# Altium schematic sheet PowerSupply.SchDoc
size A4
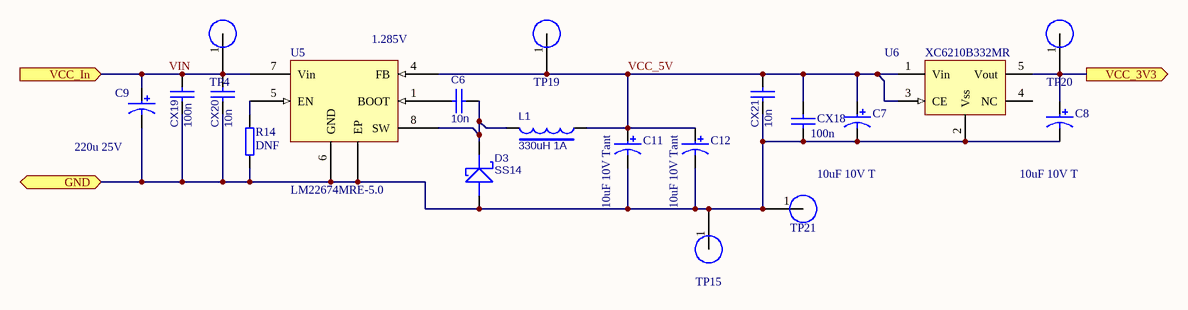
[diagram p0: PowerSupply.SchDoc]

## Parts
C6  10n  [0603]
C7  10uF 10V T  [SMD-TANT-A]
C8  10uF 10V T  [SMD-TANT-A]
C9  220u 25V  [RB.15/.32]
C11  10uF 10V Tant  [SMD-TANT-A]
C12  10uF 10V Tant  [SMD-TANT-A]
CX18  100n  [0603]
CX19  100n  [0603]
CX20  10n  [0603]
CX21  10n  [0603]
D3  SS14  [DO-214AC]
L1  330uH 1A  [INDUCTOR16]
R14  DNF  [0603]
TP4  TestPad  [TestPad]  (value not drawn)
TP15  TestPad  [TestPad]  (value not drawn)
TP19  TestPad  [TestPad]  (value not drawn)
TP20  TestPad  [TestPad]  (value not drawn)
TP21  TestPad  [TestPad]  (value not drawn)
U5  LM22674MRE-5.0  [PSOP-8]
U6  XC6210B332MR  [SOT-25-A]

## Ports
GND (bidir), VCC_3V3 (out), VCC_In (in)

## Nets
GND: C7.2 C8.2 C9.2 C11.2 C12.2 CX18.2 CX19.1 CX20.1 CX21.1 D3.A R14.1 TP15.1 TP21.1 U5.6(GND) U5.9(EP) U6.2(Vss) ; port GND
VCC_3V3: C8.1 TP20.1 U6.5(Vout) ; port VCC_3V3
VCC_5V: C7.1 C11.1 C12.1 CX18.1 CX21.2 L1.2 TP19.1 U5.4(FB) U6.1(Vin) U6.3(CE)
VIN: C9.1 CX19.2 CX20.2 TP4.1 U5.7(Vin) ; port VCC_In
NetC6_1: C6.1 U5.1(BOOT)
NetC6_2: C6.2 D3.K L1.1 U5.8(SW)
NetR14_2: R14.2 U5.5(EN)

Not connected (* = marked no-connect by the designer): U6 4(NC)

## Notes on the sheet
- (near U5) 1.285V

## Library data of the parts
C6 CX19-CX21 = CAP
C7-C9 C11 C12 = CAPACITOR POL-S
CX18 = cap
D3 = DIODE SCHOTTKY
L1 = INDUCTOR2: pin to pad: 2>0; Part Field 1: Electus LF-1402
R14 = RES8
TP4 TP15 TP19-TP21 = TestPad: Test Pad; Supplier1: N/A; PartNo1: N/A; PartNo2: N/A; Supplier2: N/A
U5 = LM22675: 0.5A SMPS, Fixed - 5V; PartNo1: LM22674MRE-5.0/NOPBCT-ND; Supplier1: DigiKey; PartNo2: 1679666RL; Supplier2: E14
U6 = XC6204B: 3.3 LDO; PartNo1: 893-1075-1-ND; Notes: 250mW Pd; Supplier1: Digi-Key; Supplier2: Element14; PartNo2: 1057803